# EAGLE design Oh Cheat (EAGLE 7.2.0)
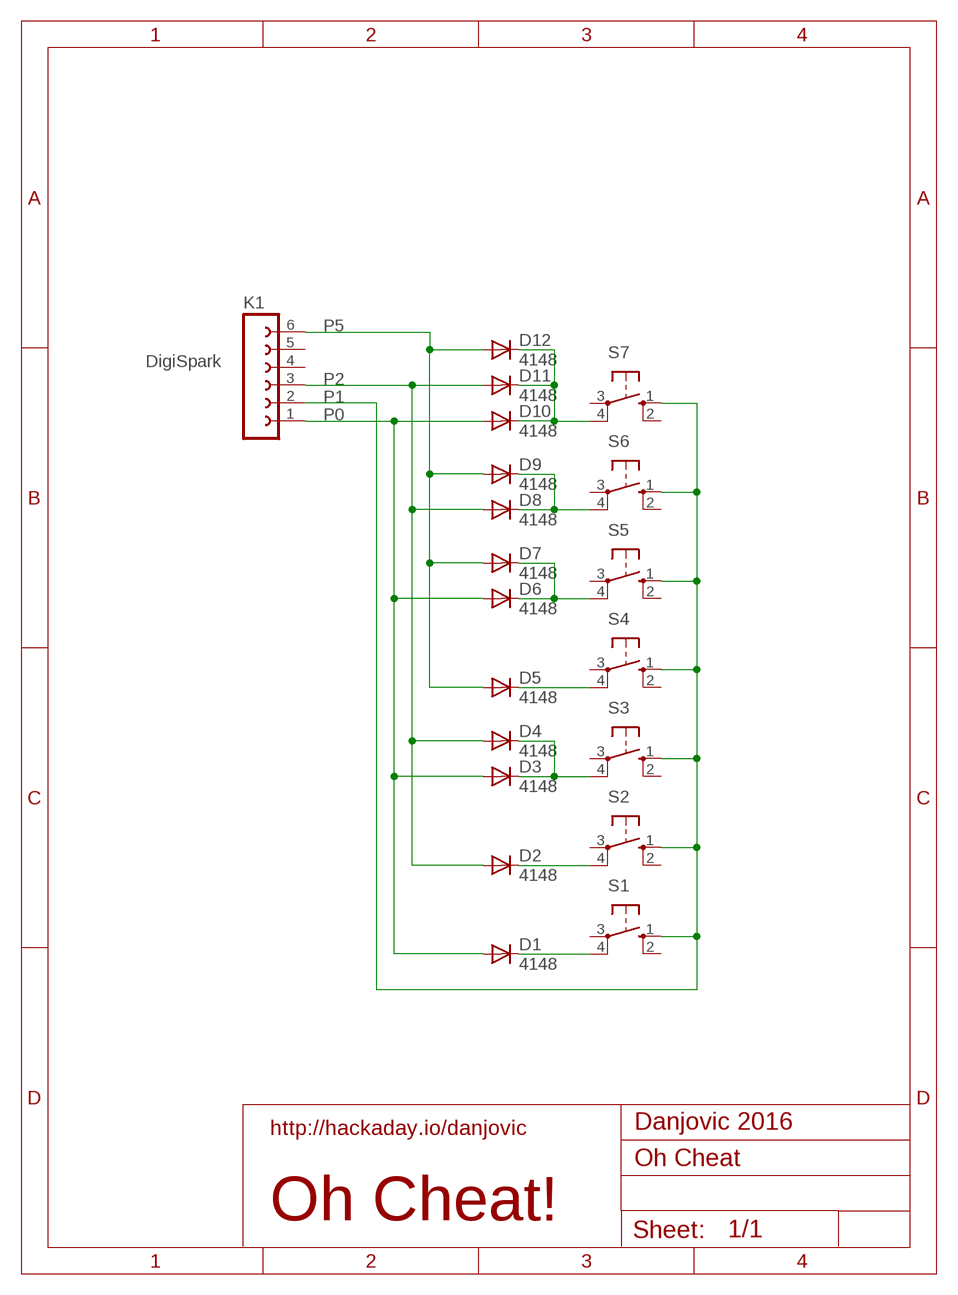
[diagram p0: schematic, sheet 1]

## Parts
D1  4148  1N4148DO35-7  [DO35-7]
D2  4148  1N4148DO35-7  [DO35-7]
D3  4148  1N4148DO35-7  [DO35-7]
D4  4148  1N4148DO35-7  [DO35-7]
D5  4148  1N4148DO35-7  [DO35-7]
D6  4148  1N4148DO35-7  [DO35-7]
D7  4148  1N4148DO35-7  [DO35-7]
D8  4148  1N4148DO35-7  [DO35-7]
D9  4148  1N4148DO35-7  [DO35-7]
D10  4148  1N4148DO35-7  [DO35-7]
D11  4148  1N4148DO35-7  [DO35-7]
D12  4148  1N4148DO35-7  [DO35-7]
K1  FE06-1  [FE06]
S1  40-XX  [B3F-40XX]
S2  40-XX  [B3F-40XX]
S3  40-XX  [B3F-40XX]
S4  40-XX  [B3F-40XX]
S5  40-XX  [B3F-40XX]
S6  40-XX  [B3F-40XX]
S7  40-XX  [B3F-40XX]

## Nets
N$1: D10.C D11.C D12.C S7.4(P1)
N$2: D8.C D9.C S6.4(P1)
N$3: D6.C D7.C S5.4(P1)
N$4: D5.C S4.4(P1)
N$5: D3.C D4.C S3.4(P1)
N$6: D2.C S2.4(P1)
N$7: D1.C S1.4(P1)
P0: D1.A D3.A D6.A D10.A K1.1
P1: K1.2 S1.1(S) S2.1(S) S3.1(S) S4.1(S) S5.1(S) S6.1(S) S7.1(S)
P2: D2.A D4.A D8.A D11.A K1.3
P5: D5.A D7.A D9.A D12.A K1.6
Unconnected: K1.4 K1.5 S1.2(S1) S1.3(P) S2.2(S1) S2.3(P) S3.2(S1) S3.3(P) S4.2(S1) S4.3(P) S5.2(S1) S5.3(P) S6.2(S1) S6.3(P) S7.2(S1) S7.3(P)

## Notes on the sheet
- DigiSpark
- http://hackaday.io/danjovic | Danjovic 2016
- Oh Cheat!

## Library data of the parts
D1-D12 = diode:1N4148: DIODE high speed (Philips)
K1 = con-lsta:FE06-1: FEMALE HEADER; OC_FARNELL: unknown; OC_NEWARK: unknown
S1-S7 = switch-omron:40-XX: OMRON SWITCH; MF: OMRON COMPONENTS USA; MPN: B3F-4000; OC_FARNELL: 176434; OC_NEWARK: 36K3105

## Board
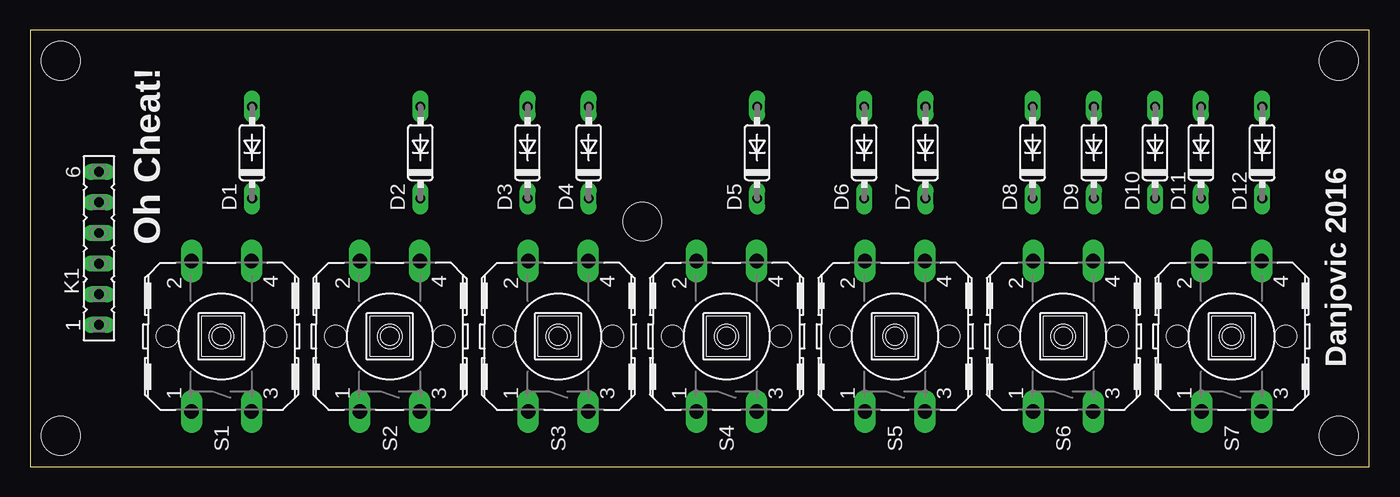
[diagram p1: board, top side]
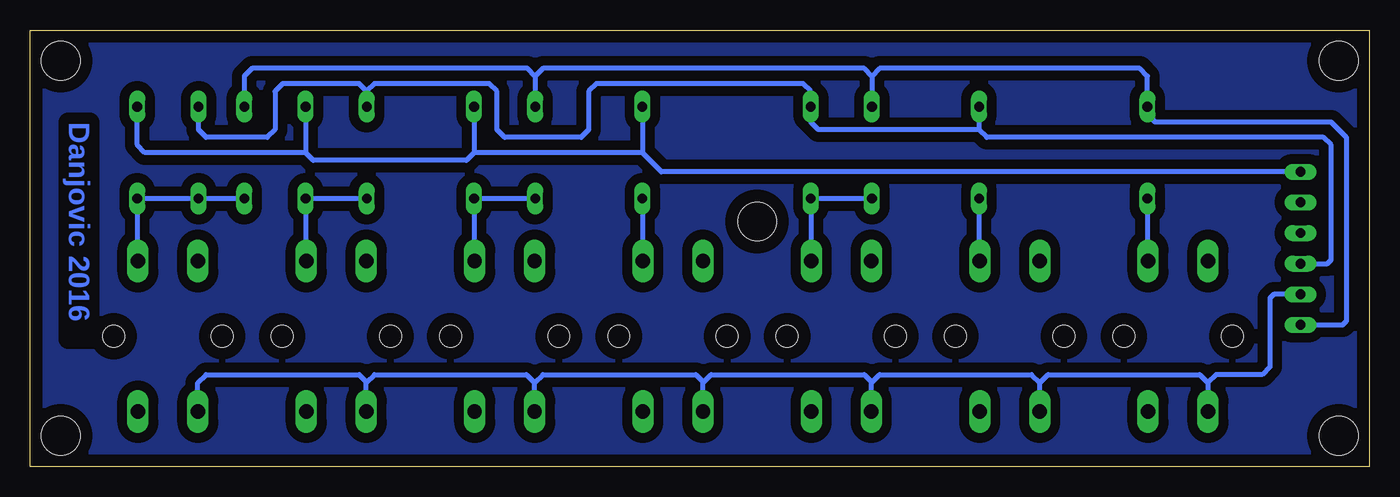
[diagram p2: board, bottom side, seen from below]

Size 111.12 x 36.2 mm. Coordinates in mm from the lower left corner, seen from the top.
Outline: 0,0 111.12,0 111.12,36.2 0,36.2 0,0
Copper layers (1*16): Top 0.035mm / dielectric 1.5mm / Bottom 0.035mm
Design rules "default": minimum track width 10mil, minimum drill 24mil, track to track 8mil, track to pad 8mil, pad to pad 8mil, via to via 8mil, smd to smd 8mil, copper to edge 40mil, drill to drill 8mil, minimum pad ring 10mil, minimum via ring 8mil, stop-mask expansion 4mil, vias tented up to drill 0mil, thermal gap 10mil
Holes 3.2 mm at 2.54,33.66 2.54,2.54 108.58,2.54 108.58,33.66 50.8,20.32

### Footprints (pad centres in the part's own frame; a part is rotated, then mirrored left to right if it is on the bottom)
DO35-7 = drill 0.813 long: A 3.81,0; C -3.81,0
FE06 = drill 0.813 long: 1 -6.35,0; 2 -3.81,0; 3 -1.27,0; 4 1.27,0; 5 3.81,0; 6 6.35,0
B3F-40XX = drill 1.194 long: 1 -6.248,2.489; 2 6.248,2.489; 3 -6.248,-2.489; 4 6.248,-2.489 | hole 1.803: 0,-4.496; 0,4.496

### Placement (x,y rotation side)
D1  18.41,26.04 90 top
D2  32.38,26.04 90 top
D3  41.27,26.04 90 top
D4  46.35,26.04 90 top
D5  60.32,26.04 90 top
D6  69.22,26.04 90 top
D7  74.3,26.04 90 top
D8  83.19,26.04 90 top
D9  88.27,26.04 90 top
D10  93.34,26.04 90 top
D11  97.16,26.04 90 top
D12  102.23,26.04 90 top
K1  5.71,18.1 90 top
S1  15.88,10.79 90 top
S2  29.85,10.79 90 top
S3  43.81,10.79 90 top
S4  57.78,10.79 90 top
S5  71.75,10.79 90 top
S6  85.72,10.79 90 top
S7  99.69,10.79 90 top

### Tracks (layer width: path | path; a pad name or v marks a point on that pad's centre or on a via)
N$1
  Bottom 0.406: D10.C D11.C D12.C 102.23,17.09 S7.4
N$2
  Bottom 0.406: D8.C D9.C 88.27,17.09 S6.4
N$3
  Bottom 0.406: D6.C D7.C 74.3,17.09 S5.4
N$4
  Bottom 0.406: D5.C 60.32,17.09 S4.4
N$5
  Bottom 0.406: D3.C D4.C 46.35,17.09 S3.4
N$6
  Bottom 0.406: D2.C 32.38,17.09 S2.4
N$7
  Bottom 0.406: D1.C 18.41,17.09 S1.4
N$8
  pour Bottom (isolate 0.813): 0,36.2 0,0 111.12,0 111.12,36.2
P0
  Bottom 0.406: 41.27,32.38 40.64,33.02 19.05,33.02 18.41,32.38 D1.A 18.41,29.21 17.78,28.57 3.17,28.57 1.9,27.3 1.9,12.06 2.22,11.75 K1.1 | 41.27,32.38 41.91,33.02 68.58,33.02 69.22,32.38 | 69.22,32.38 69.85,33.02 92.71,33.02 93.34,32.38 D10.A | 69.22,32.38 D6.A | 41.27,32.38 D3.A
P1
  Bottom 0.406: 13.39,6.93 12.7,7.62 8.89,7.62 8.25,8.26 8.25,13.97 7.94,14.29 K1.2 | 13.39,6.93 S1.1 | S2.1 27.36,6.93 | 27.36,6.93 26.67,7.62 14.07,7.62 13.39,6.93 | S3.1 41.33,6.93 41.27,6.99 | 41.27,6.99 40.64,7.62 28.04,7.62 27.36,6.93 | S4.1 55.3,6.93 55.24,6.99 | 55.24,6.99 54.61,7.62 41.91,7.62 41.27,6.99 | S5.1 69.27,6.93 | 69.27,6.93 68.58,7.62 55.88,7.62 55.24,6.99 | S6.1 83.24,6.93 83.19,6.99 | 83.19,6.99 82.55,7.62 69.95,7.62 69.27,6.93 | S7.1 97.21,6.93 96.52,7.62 83.82,7.62 83.19,6.99
P2
  Bottom 0.406: 32.38,27.94 31.75,27.3 3.81,27.3 3.17,26.67 3.17,17.14 3.49,16.83 K1.3 | 32.38,27.94 45.72,27.94 46.35,28.57 D4.A 46.35,31.11 46.99,31.75 64.14,31.75 64.77,31.11 64.77,27.94 65.41,27.3 71.75,27.3 72.39,27.94 72.39,31.11 73.02,31.75 82.55,31.75 83.19,31.11 | D8.A 83.19,31.11 | 83.19,31.11 83.82,31.75 90.17,31.75 90.8,31.11 90.8,27.94 91.44,27.3 96.52,27.3 97.16,27.94 D11.A | D2.A 32.38,27.94
P5
  Bottom 0.406: 60.32,26.04 58.74,24.45 K1.6 | 60.32,26.04 74.3,26.04 | 74.3,26.04 74.93,25.4 87.63,25.4 88.27,26.04 | 88.27,26.04 101.6,26.04 102.23,26.67 D12.A | D9.A 88.27,26.04 | D7.A 74.3,26.04 | D5.A 60.32,26.04

### Text on the board
Bottom: Danjovic 2016
tPlace: Oh Cheat! | Danjovic 2016